# EAGLE design Moteino (EAGLE 7.3.0)
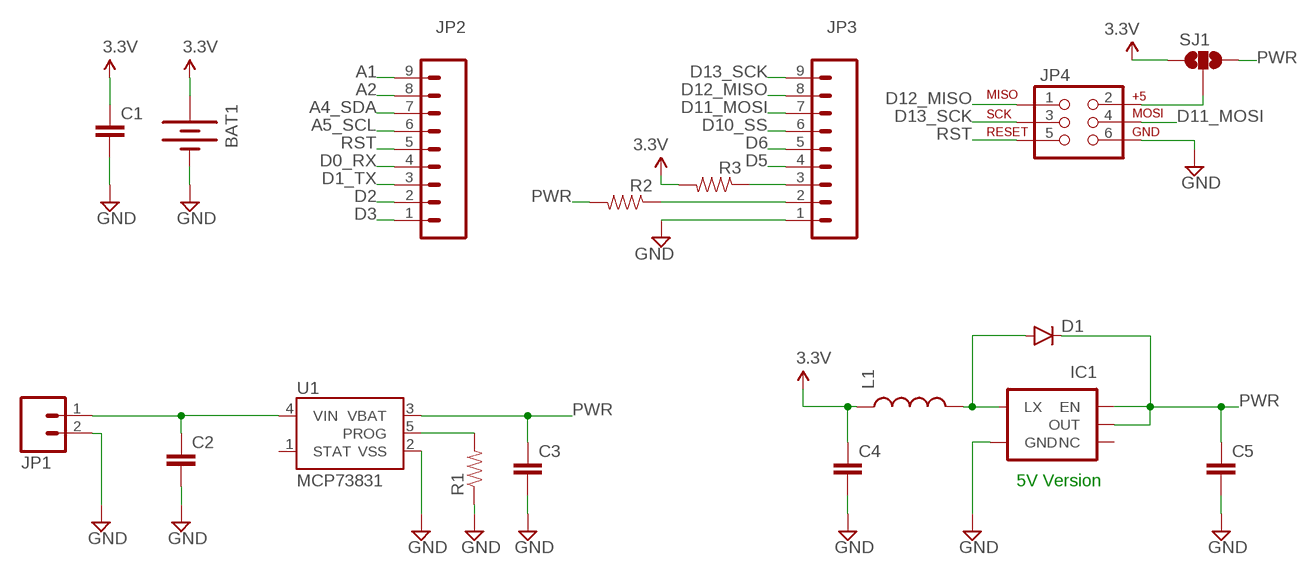
[diagram p0: schematic, sheet 1]

## Parts
BAT1  BATTERY12MM  [BATTCON_12MM]
C1  CAP0603-CAP  [0603-CAP]
C2  CAP0603-CAP  [0603-CAP]
C3  CAP0603-CAP  [0603-CAP]
C4  CAP0603-CAP  [0603-CAP]
C5  CAP0603-CAP  [0603-CAP]
D1  DIODESMA  [SMA-DIODE]
IC1  V_REG_NCP1400SOT23-5  [SOT23-5]
JP1  M02PTH  [1X02]
JP2  M09  [1X09]
JP3  M09  [1X09]
JP4  AVR_SPI_PRG_6TESTPOINTS  [2X3_TEST_POINTS]
L1  INDUCTORINDUCTOR_4.7UH  [INDUCTOR_4.7UH]
R1  RESISTOR0603-RES  [0603-RES]
R2  RESISTOR0603-RES  [0603-RES]
R3  RESISTOR0603-RES  [0603-RES]
SJ1  JUMPER-PAD-3-NOFULL_BOX_SILK  [PAD-JUMPER-3-NO_YES_SILK_FULL_BOX]
U1  MCP73831  [SOT23-5]

## Nets
A1: JP2.9
A2: JP2.8
A4_SDA: JP2.7
A5_SCL: JP2.6
D0_RX: JP2.4
D1_TX: JP2.3
D2: JP2.2
D3: JP2.1
D5: JP3.4
D6: JP3.5
D10_SS: JP3.6
D11_MOSI: JP3.7 JP4.4
D12_MISO: JP3.8 JP4.1
D13_SCK: JP3.9 JP4.3
GND [power]: BAT1.GND(-) C1.2 C2.2 C3.2 C4.2 C5.2 IC1.4(GND) JP1.2 JP3.1 JP4.6 R1.1 U1.2(VSS)
N$1: JP3.2 R2.1
N$2: JP3.3 R3.1
N$3: C2.1 JP1.1 U1.4(VIN)
N$4: R1.2 U1.5(PROG)
N$7: D1.A L1.P$2
N$10: JP4.2 SJ1.2
PWR: C3.1 C5.1 D1.C IC1.1(EN) IC1.2(OUT) R2.2 SJ1.3 U1.3(VBAT)
RST: JP2.5 JP4.5
VCC: BAT1.PWR@1(+) C1.1 C4.1 L1.P$1 R3.2 SJ1.1 ; supply symbol labelled 3.3V
Unconnected: IC1.3(NC) IC1.5(LX) U1.1(STAT)

## Notes on the sheet
- 5V Version

## Library data of the parts
BAT1 = SparkFun-Electromechanical:BATTERY: Battery Holders Various common sizes : AA, AAA, 18650 (PRT-12895), 20mm coin cell and 12mm coin cell. 20MM_4LEGS, BATT-10373; PROD_ID: BATT-08044
C1-C5 = SparkFun-Capacitors:CAP: Capacitor Standard 0603 ceramic capacitor, and 0.1" leaded capacitor.
D1 = SparkFun-DiscreteSemi:DIODE: Diode These are standard reverse protection diodes and small signal diodes. SMA package can handle up to about 1A. SOD-323 can handle about 200mA. What the SOD-323 package when ordering, there are some mfgs out there that are 5-pin packages.
IC1 = SparkFun-PowerIC:V_REG_NCP1400: Switching step-up voltage regulator NCP1400 switiching regulator takes single cell AA and outputs 100mA at 3.3V or 5V with minimal number of external components.
JP1 = SparkFun-Connectors:M02: Standard 2-pin 0.1" header. Use with - straight break away headers ( PRT-00116) - right angle break away headers (PRT-00553) - swiss pins (PRT-00743) - machine pins (PRT-00117) - female headers (PRT-00115) Molex polarized connector foot print use with: PRT-08233 with associated crimp pins and housings. 2.54_SCREWTERM for use with PRT-10571. 3.5mm Screw Terminal footprints for PRT-08084 5mm Screw Terminal footprints for use with PRT-08432
JP2 JP3 = SparkFun-Connectors:M09: Header 9 Standard 9-pin 0.1" header. Use with straight break away headers (SKU : PRT-00116), right angle break away headers (PRT-00553), swiss pins (PRT-00743), machine pins (PRT-00117), and female headers (PRT-00115).
JP4 = SparkFun-Connectors:AVR_SPI_PRG_6: AVR ISP 6 Pin This is the reduced ISP connector for AVR programming. Common on Arduino. This footprint will take up less PCB space and can be used with a 10-pin to 6-pin adapter such as SKU: BOB-08508 **Special note about "TEST_POINT" package. The stop mask is on the top side, so if you want your programming test points to be on the bottom of your board, make sure to place this package on the bottom side of the board. This also ensure that the orientation to program from the bottom side will be correct.
L1 = SparkFun-Passives:INDUCTOR: Inductors Basic Inductor/Choke - 0603 and 1206. Footprints are not proven and vary greatly between part numbers. INDUCTOR POWER 3.3UH 4.0A SMD 0.197" L x 0.197" W x 0.177" H (5.00mm x 5.00mm x 4.50mm); PROD_ID: NDUC-10146
R1-R3 = SparkFun-Passives:RESISTOR: Resistor Basic schematic elements and footprints for 0603, 1206, and PTH resistors.
SJ1 = SparkFun-Passives:JUMPER-PAD-3-NO
U1 = SparkFun-PowerIC:MCP73831: Miniature single cell, fully integrated Li-Ion, Li-polymer charge management controller http://ww1.microchip.com/downloads/en/DeviceDoc/20001984g.pdf IC-09995; PROD_ID: IC-09995

## Board
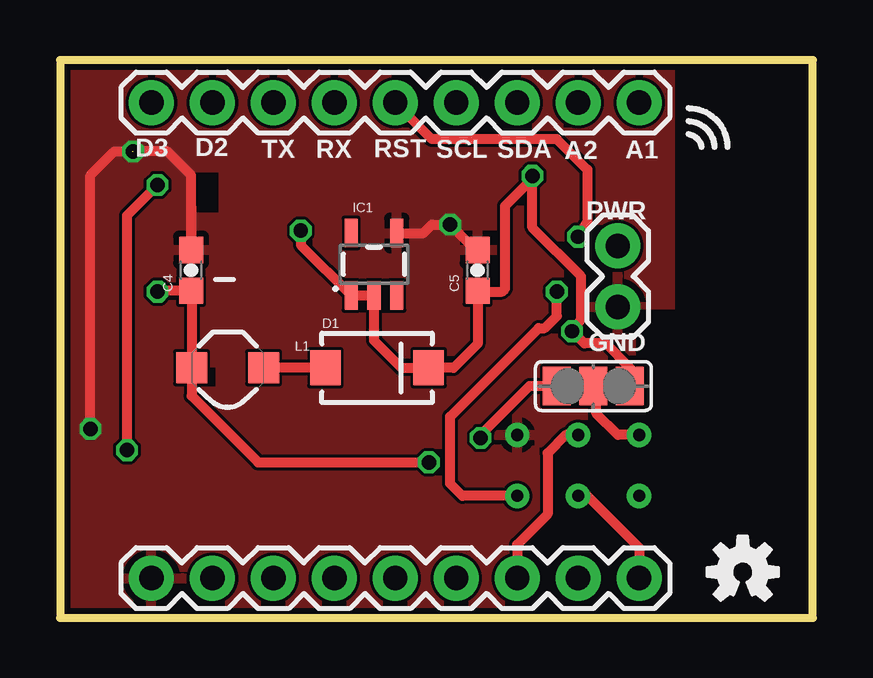
[diagram p1: board, top side]
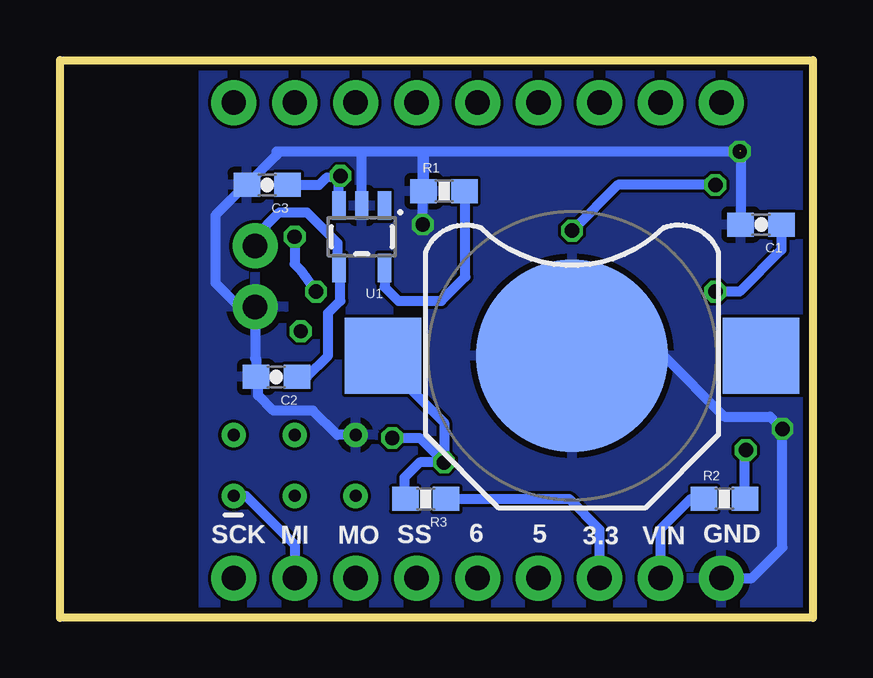
[diagram p2: board, bottom side, seen from below]

Size 31.37 x 23.24 mm. Coordinates in mm from the lower left corner, seen from the top.
Outline: 0,0 31.37,0 31.37,23.24 0,23.24 0,0
Copper layers (1*16): Top 0.035mm / dielectric 1.5mm / Bottom 0.035mm
Design rules "dirt_cheap_dirty_boards.v1": minimum track width 5mil, minimum drill 12mil, track to track 5mil, track to pad 5mil, pad to pad 5mil, via to via 5mil, smd to smd 0mil, copper to edge 10mil, drill to drill 10mil, minimum pad ring 10mil, minimum via ring 6mil, stop-mask expansion 2mil, vias tented up to drill 25mil, thermal gap 10mil
tRestrict: area 24,8.9 to 28.8,12.8; area 5.6,16.9 to 6.6,18.5; area 5,9.7 to 6.5,10.4
bRestrict: area 27.2,17.7 to 29,18.7; area 20.8,13.8 to 22.6,14.9; area 21.3,12.6 to 21.8,13.2; area 20.4,12.6 to 21,13.2; area 19.9,12.8 to 20.4,13.5; area 19.9,13.4 to 20.4,14; area 26.3,18.9 to 26.8,19.5; area 26.3,17.9 to 26.8,18.5; area 27.3,19.1 to 27.8,19.8; area 27.7,18.8 to 28.8,19.6

### Footprints (pad centres in the part's own frame; a part is rotated, then mirrored left to right if it is on the bottom)
BATTCON_12MM = smd 8 x 8: GND 0,0 | smd 3.175 x 3.175: PWR@1 -7.874,0; PWR@2 7.874,0
0603-CAP = smd 1.1 x 1: 1 -0.85,0; 2 0.85,0
SMA-DIODE = smd 1.27 x 1.47: A -2.15,0; C 2.15,0
SOT23-5 = smd 0.55 x 1.2: 1 -0.95,-1.3; 2 0,-1.3; 3 0.95,-1.3; 4 0.95,1.3; 5 -0.95,1.3
1X02 = drill 1.016 pad 1.88: 1 0,0; 2 2.54,0
1X09 = drill 1.016 pad 1.88: 1 0,0; 2 2.54,0; 3 5.08,0; 4 7.62,0; 5 10.16,0; 6 12.7,0; 7 15.24,0; 8 17.78,0; 9 20.32,0
2X3_TEST_POINTS = drill 0.508: 1 -2.54,-1.27; 2 -2.54,1.27; 3 0,-1.27; 4 0,1.27; 5 2.54,-1.27; 6 2.54,1.27
INDUCTOR_4.7UH = smd 1.3 x 1.3: P$1 -1.5,0; P$2 1.5,0
0603-RES = smd 1.1 x 1: 1 -0.85,0; 2 0.85,0
PAD-JUMPER-3-NO_YES_SILK_FULL_BOX = smd 1.168 x 1.6: 1 -1.524,0; 2 0,0; 3 1.524,0

### Placement (x,y rotation side)
BAT1  10.03,10.92 0 bottom
C1  2.16,16.38 180 bottom
C2  22.35,10.03 180 bottom
C3  22.73,18.03 180 bottom
C4  5.46,14.48 90 top
C5  17.4,14.48 90 top
D1  13.21,10.41 0 top
IC1  13.08,14.73 0 top
JP1  23.24,15.49 270 top
JP2  3.81,21.46 0 top
JP3  3.81,1.65 0 top
JP4  21.59,6.35 0 bottom
L1  6.98,10.41 0 top
R1  15.37,17.78 0 bottom
R2  3.68,4.95 0 bottom
R3  16.13,4.95 180 bottom
SJ1  22.22,9.65 0 top
U1  18.8,15.88 180 bottom
U$3  [OSHW-LOGO-S]  28.45,1.91 0 top

### Tracks (layer width: path | path; a pad name or v marks a point on that pad's centre or on a via)
D11_MOSI
  Top 0.406: JP4.4 21.08,7.62 20.32,6.86 20.32,4.32 19.05,3.05 JP3.7
D12_MISO
  Bottom 0.406: JP4.1 23.62,5.08 21.59,3.05 JP3.8
D13_SCK
  Top 0.406: JP4.3 21.97,5.08 24.13,2.92 JP3.9
GND  (via drill 0.6)  (1 unrouted)
  Top 0.406: v1.27,7.87 1.27,18.43 2.27,19.43 v3.05,19.43 4.46,19.43 5.46,18.43 C4.2 5.46,17.14 | 13.97,16.03 IC1.4 15.14,16.03 15.49,16.38 v16.26,16.38 17.31,15.33 C5.2
  Bottom 0.406: U1.2 18.8,19.43 | 18.8,19.43 16.26,19.43 | 16.26,19.43 16.22,19.43 | 16.22,19.43 R1.1 | R1.1 16.26,17.78 16.26,19.43 | 16.22,19.43 v3.05,19.43 | 3.01,19.43 C1.2 | JP3.1 2.54,1.65 1.27,2.92 v1.27,7.87 1.78,8.38 3.68,8.38 6.22,10.92 BAT1.GND | JP4.6 19.81,7.62 20.83,8.64 22.48,8.64 23.11,9.27 23.11,9.95 C2.2 23.2,10.79 23.24,10.79 JP1.2 23.89,12.95 24.89,13.95 24.89,16.76 23.62,18.03 | 23.62,18.03 C3.2 22.35,19.27 22.35,19.43 18.8,19.43 | 23.62,18.03 23.62,18.16 | v16.26,16.38 16.26,17.74 R1.1
  pour Top: -0.25,23.5 24.76,23.5 arc-90 25.4,22.86 25.4,-0.13 0.38,-0.13 arc-90 -0.25,0.51 -0.25,23.37
  pour Bottom: 0.76,23.62 24.76,23.62 arc-90 25.4,22.99 25.4,-0.13 0.38,-0.13 arc-90 -0.25,0.51 -0.25,23.5 0.76,23.5
N$1
  Bottom 0.406: R2.1 5.08,4.95 6.35,3.68 JP3.2
N$2
  Bottom 0.406: R3.1 10.16,4.95 8.89,3.68 JP3.3
N$3
  Bottom 0.406: C2.1 21.08,10.03 20.19,10.92 20.19,12.7 19.68,13.21 19.68,14.51 U1.4 19.81,14.64 19.81,15.62 21.08,16.89 22.22,16.89 23.24,15.88 JP1.1
N$4
  Bottom 0.406: R1.2 14.48,17.78 14.48,14.21 15.48,13.21 17.27,13.21 17.85,13.78 U1.5
N$7
  Top 0.406: D1.A L1.P$2
N$10
  Top 0.406: JP4.2 23.24,7.62 22.35,8.51 22.35,9.53 SJ1.2
PWR  (via drill 0.6)
  Top 0.406: v2.79,6.99 2.79,16.76 v4.06,18.03 | v10.03,16.13 10.03,15.53 IC1.1 IC1.2 13.08,11.56 14.22,10.41 D1.C 16.4,10.41 17.4,11.41 C5.1 17.44,13.59 18.41,13.59 18.54,13.72 18.54,17.16 19.8,18.41 v19.68,18.41 19.68,16.26 21.72,14.22 21.72,12.45 v21.34,11.94 21.84,11.43 22.73,11.43 23.75,10.41 SJ1.3
  Bottom 0.406: C3.1 20.57,18.03 20.25,18.35 v19.68,18.41 19.75,18.35 U1.3 | R2.2 2.83,6.95 v2.79,6.99 | v4.06,18.03 8.13,18.03 v10.03,16.13
RST  (via drill 0.6)
  Top 0.406: JP4.5 16.76,5.08 16.26,5.59 16.26,8.38 19.94,12.06 20.19,12.06 20.7,12.57 v20.7,13.59 20.45,13.59 | JP2.5 15.49,19.94 20.7,19.94 21.97,18.67 21.97,16.51 v21.59,15.88
  Bottom 0.406: v21.59,15.88 21.59,14.73 21.34,14.48 v20.7,13.59
VCC  (via drill 0.6)
  Top 0.406: v4.06,13.59 4.1,13.63 C4.1 5.48,13.63 L1.P$1 5.48,9.25 8.26,6.48 v15.37,6.48 | SJ1.1 19.56,9.65 17.53,7.62 v17.53,7.49
  Bottom 0.406: 17.02,4.95 R3.2 17.02,4.99 17.02,5.84 16.38,6.48 v15.37,6.48 | BAT1.PWR@1 17.91,10.02 17.26,10.02 15.37,8.13 v15.37,6.48 | C1.1 1.31,15.33 3.05,13.59 v4.06,13.59 | v17.53,7.49 16.38,7.49 v15.37,6.48

### Text on the board
bPlace: GND | VIN | 3.3 | 5 | 6 | SS | MO | MI | SCK
tDocu: REG
_tsilk: D3 | D2 | TX | RX | A2 | A1 | RST | SCL | SDA | PWR | GND